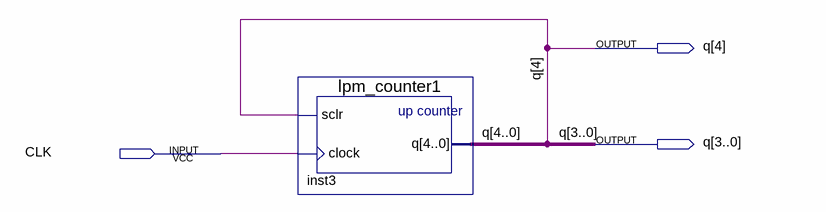
[diagram p0: schematic sheet]
// Quartus schematic 8-3-Counter.bdf as structural Verilog: 1 symbols, 3 pins
module \8-3-Counter  (
  input  CLK,
  output [4:0] q
);

  lpm_counter1 inst3 (.sclr(q[4]), .clock(CLK), .q(q));
endmodule
